# Altium schematic sheet LED.SchDoc
size A; SheetNumber: 3; SheetTotal: 3
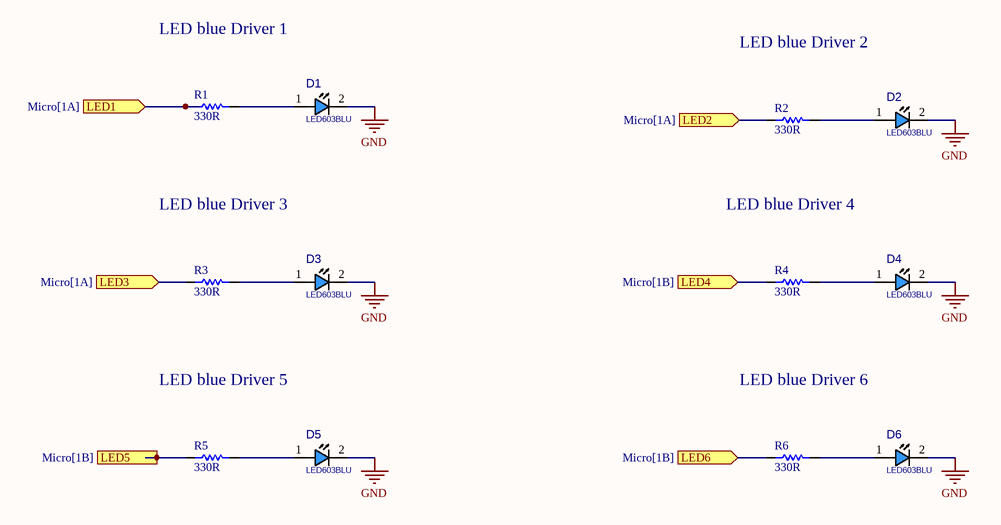
[diagram p0: LED.SchDoc]

## Parts
D1  LED603BLU  [LED0603BLU]
D2  LED603BLU  [LED0603BLU]
D3  LED603BLU  [LED0603BLU]
D4  LED603BLU  [LED0603BLU]
D5  LED603BLU  [LED0603BLU]
D6  LED603BLU  [LED0603BLU]
R1  330R  [RES 0805-MIL]
R2  330R  [RES 0805-MIL]
R3  330R  [RES 0805-MIL]
R4  330R  [RES 0805-MIL]
R5  330R  [RES 0805-MIL]
R6  330R  [RES 0805-MIL]

## Ports
LED1 (in, see Micro[1A]), LED2 (in, see Micro[1A]), LED3 (in, see Micro[1A]), LED4 (in, see Micro[1B]), LED5 (in, see Micro[1B]), LED6 (in, see Micro[1B])

## Nets
GND: D1.2(CATHODE) D2.2(CATHODE) D3.2(CATHODE) D4.2(CATHODE) D5.2(CATHODE) D6.2(CATHODE)
LED1: R1.1 ; port LED1
LED2: R2.1 ; port LED2
LED3: R3.1 ; port LED3
LED4: R4.1 ; port LED4
LED5: R5.1 ; port LED5
LED6: R6.1 ; port LED6
NetD1_1: D1.1(ANODE) R1.2
NetD2_1: D2.1(ANODE) R2.2
NetD3_1: D3.1(ANODE) R3.2
NetD4_1: D4.1(ANODE) R4.2
NetD5_1: D5.1(ANODE) R5.2
NetD6_1: D6.1(ANODE) R6.2

## Notes on the sheet
- LED blue Driver 1
- LED blue Driver 2
- LED blue Driver 3
- LED blue Driver 4
- LED blue Driver 5
- LED blue Driver 6

## Library data of the parts
D1-D6 = LED_SMD_0603_BLU: LED, SMD, 0603, BLUE; PARAM: 30mA, 470nm, 120° Angle; DESC: DESCRIPTION; MANF_P#: MANF_PART#; PARAM2: 2.2~3V; MANF: MANF; ASSEMBLY: ASSEMBLY; PRICE: PRICE; VALUE: LED603BLU
R1-R6 = Resistor SMD: Resistor; Tolerance: 5%; Power: 1/8 W; Value: 330R